# Altium schematic sheet Input Connector.SchDoc
size B
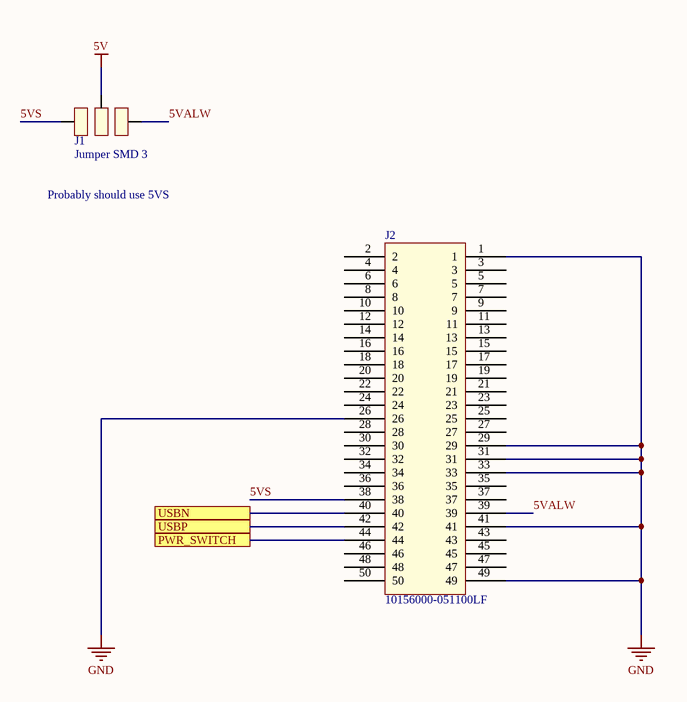
[diagram p0: Input Connector.SchDoc]

## Parts
J1  Jumper SMD 3  [Jumper SMD 3]
J2  10156000-051100LF  [10156000-051100LF]

## Ports
PWR_SWITCH, USBN, USBP

## Nets
5V: J1.2
GND: J2.1 J2.26 J2.29 J2.31 J2.33 J2.41 J2.49
5VALW: J1.1 J2.39
5VS: J1.3 J2.38
PWR_SWITCH: J2.44 ; port PWR_SWITCH
USBN: J2.40 ; port USBN
USBP: J2.42 ; port USBP

Not connected (* = marked no-connect by the designer): J2 2 3 4 5 6 7 8 9 10 11 12 13 14 15 16 17 18 19 20 21 22 23 24 25 27 28 30 32 34 35 36 37 43 45 46 47 48 50

## Notes on the sheet
- Probably should use 5VS